# EAGLE design oscilateur (EAGLE 6.3)
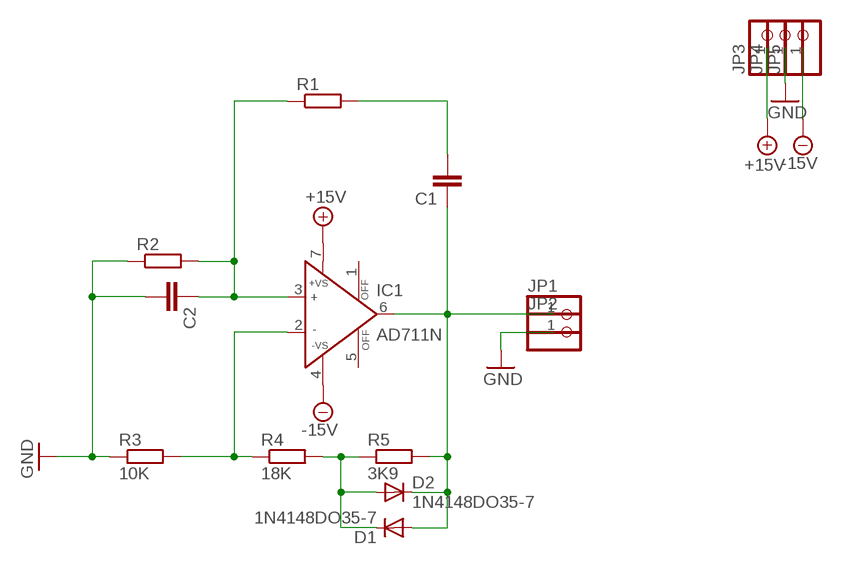
[diagram p0: schematic, sheet 1]

## Parts
C1  C-EU075-032X103  [C075-032X103]
C2  C-EU075-032X103  [C075-032X103]
D1  1N4148DO35-7  [DO35-7]
D2  1N4148DO35-7  [DO35-7]
IC1  AD711N  [DIL08]
JP1  PINHD-1X1  [1X01]
JP2  PINHD-1X1  [1X01]
JP3  PINHD-1X1  [1X01]
JP4  PINHD-1X1  [1X01]
JP5  PINHD-1X1  [1X01]
R1  R-EU_0204/7  [0204/7]
R2  R-EU_0204/7  [0204/7]
R3  10K  R-EU_0204/7  [0204/7]
R4  18K  R-EU_0204/7  [0204/7]
R5  3K9  R-EU_0204/7  [0204/7]

## Nets
+15V: IC1.7(+VS) JP3.1
-15V: IC1.4(-VS) JP5.1
GND: C2.2 JP2.1 JP4.1 R2.1 R3.1
N$1: IC1.2(IN-) R3.2 R4.1
N$2: D1.C D2.A R4.2 R5.1
N$3: C1.1 D1.A D2.C IC1.6(OUT) JP1.1 R5.2
N$4: C1.2 R1.2
N$5: C2.1 IC1.3(IN+) R1.1 R2.2
Unconnected: IC1.1(OFF) IC1.5(OFF)

## Library data of the parts
C1 C2 = resistor:C-EU: CAPACITOR, European symbol
D1 D2 = diode:1N4148: DIODE high speed (Philips)
IC1 = analog-devices:AD711: Precision, Low Cost, High Speed, BiFET Op Amp Source: http://www.analog.com/static/imported-files/data_sheets/AD711.pdf; MPN: AD711BQ; OC_FARNELL: 9604839; OC_NEWARK: 66F5826
JP1-JP5 = pinhead:PINHD-1X1: PIN HEADER
R1-R5 = resistor:R-EU_: RESISTOR, European symbol

## Board
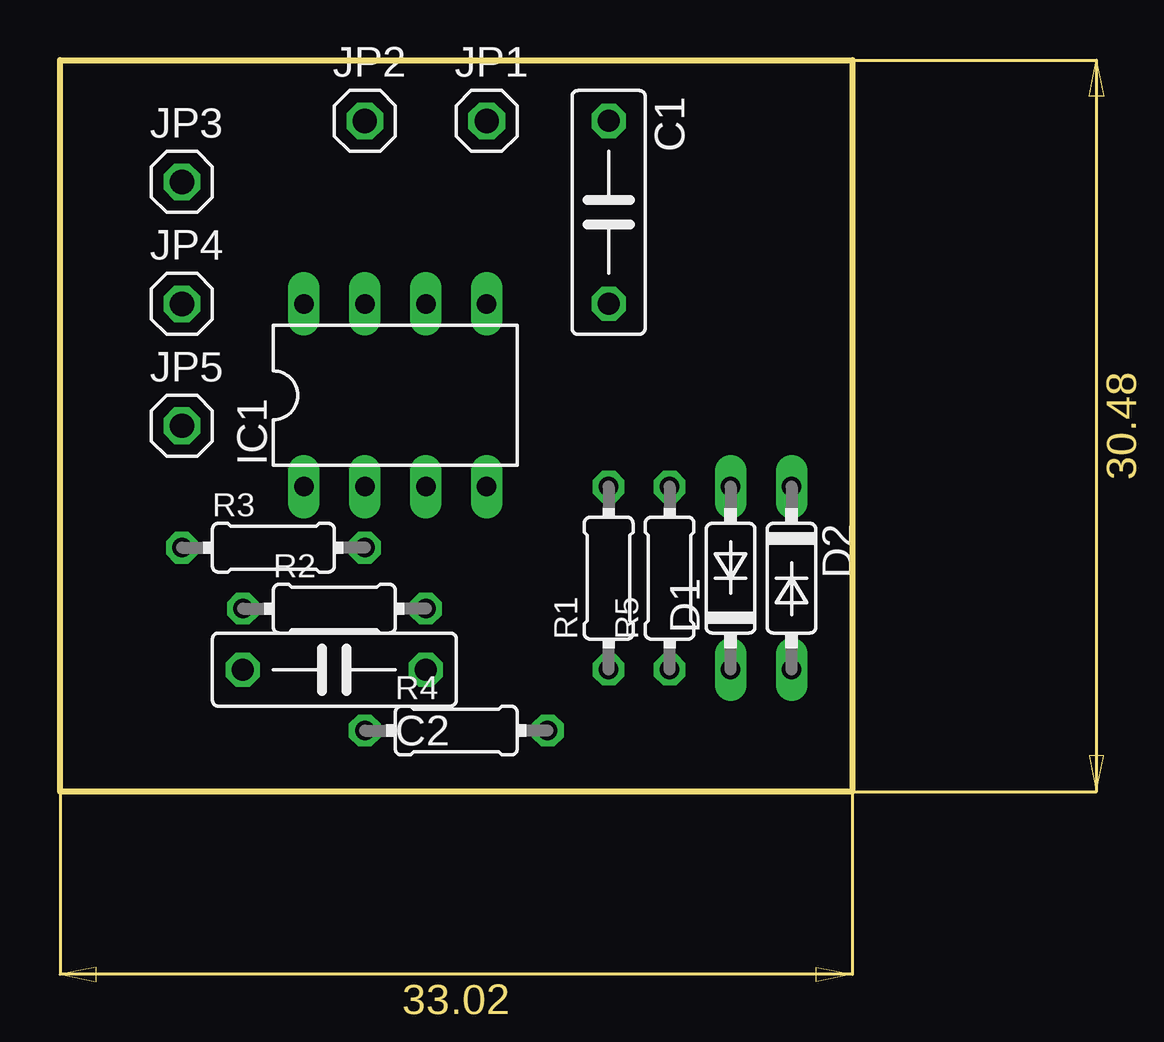
[diagram p1: board, top side]
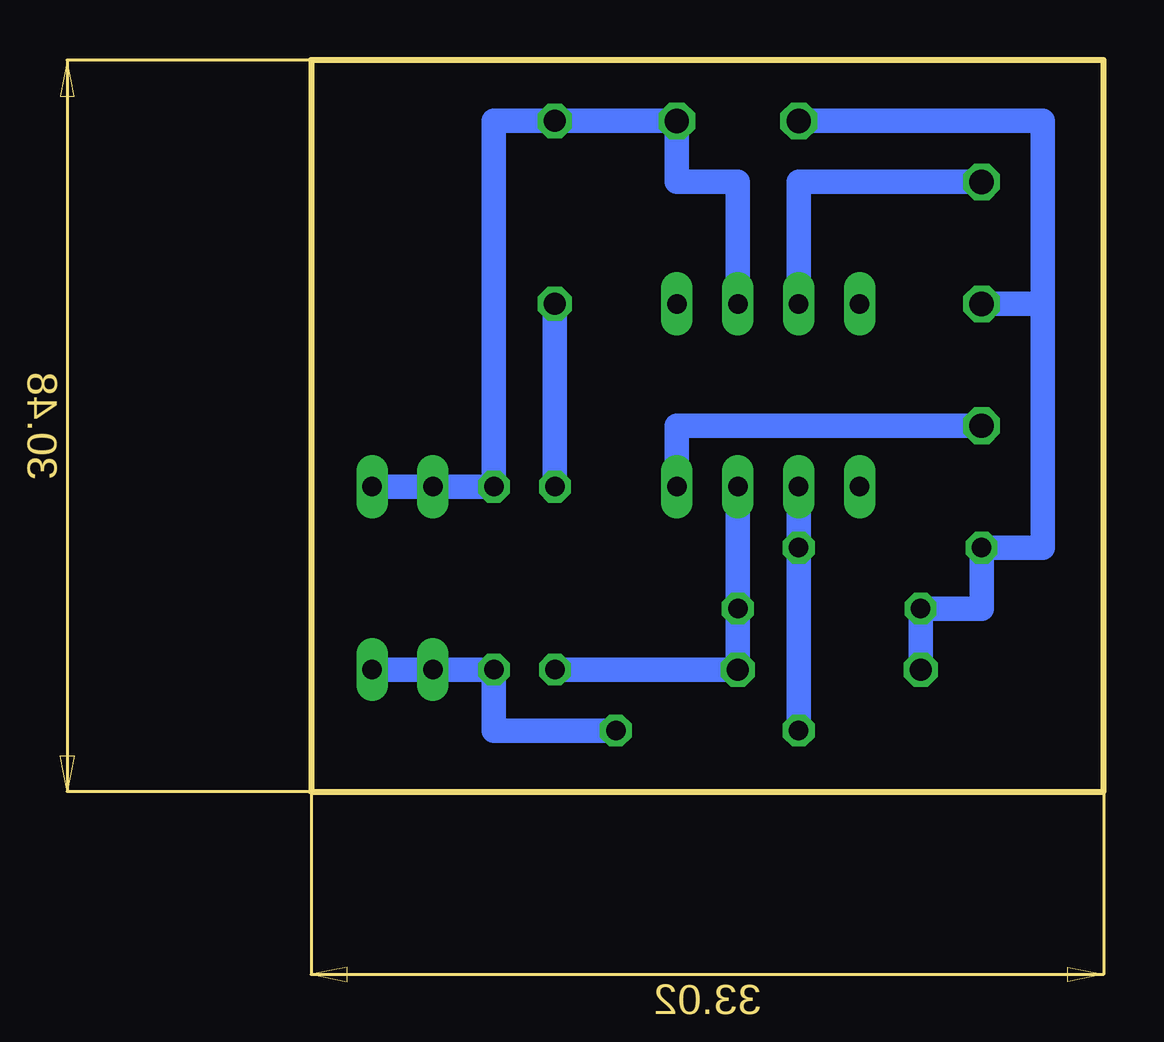
[diagram p2: board, bottom side, seen from below]

Size 33.02 x 30.48 mm. Coordinates in mm from the lower left corner, seen from the top.
Outline: 0,30.48 33.02,30.48 33.02,0 0,0 0,30.48
Copper layers (1*16): Top 0.035mm / dielectric 1.5mm / Bottom 0.035mm
Design rules "default": minimum track width 10mil, minimum drill 24mil, track to track 8mil, track to pad 8mil, pad to pad 8mil, via to via 8mil, smd to smd 8mil, copper to edge 40mil, drill to drill 8mil, minimum pad ring 10mil, minimum via ring 8mil, stop-mask expansion 4mil, vias tented up to drill 0mil, thermal gap 10mil

### Footprints (pad centres in the part's own frame; a part is rotated, then mirrored left to right if it is on the bottom)
C075-032X103 = drill 0.914 octagon: 1 -3.81,0; 2 3.81,0
DO35-7 = drill 0.813 long: A 3.81,0; C -3.81,0
DIL08 = drill 0.813 long: 1 -3.81,-3.81; 2 -1.27,-3.81; 3 1.27,-3.81; 4 3.81,-3.81; 5 3.81,3.81; 6 1.27,3.81; 7 -1.27,3.81; 8 -3.81,3.81
1X01 = drill 1.016 octagon: 1 0,0
0204/7 = drill 0.813 octagon: 1 -3.81,0; 2 3.81,0

### Placement (x,y rotation side)
C1  22.86,24.13 270 top
C2  11.43,5.08 180 top
D1  27.94,8.89 90 top
D2  30.48,8.89 270 top
IC1  13.97,16.51 0 top
JP1  17.78,27.94 0 top
JP2  12.7,27.94 0 top
JP3  5.08,25.4 0 top
JP4  5.08,20.32 0 top
JP5  5.08,15.24 0 top
R1  22.86,8.89 90 top
R2  11.43,7.62 0 top
R3  8.89,10.16 0 top
R4  16.51,2.54 0 top
R5  25.4,8.89 90 top

### Tracks (layer width: path | path; a pad name or v marks a point on that pad's centre or on a via)
+15V
  Bottom 1.016: JP3.1 12.7,25.4 IC1.7
-15V
  Bottom 1.016: JP5.1 17.78,15.24 IC1.4
GND
  Bottom 1.016: JP2.1 2.54,27.94 2.54,20.32 | 2.54,20.32 JP4.1 | 2.54,20.32 2.54,10.16 R3.1 5.08,7.62 R2.1 C2.2
N$1
  Bottom 1.016: IC1.2 R3.2 R4.1
N$2
  Bottom 1.016: R4.2 25.4,2.54 R5.1 D1.C D2.A
N$3
  Bottom 1.016: D2.C D1.A R5.2 25.4,27.94 C1.1 JP1.1 17.78,25.4 15.24,25.4 IC1.6
N$4
  Bottom 1.016: C1.2 R1.2
N$5
  Bottom 1.016: IC1.3 R2.2 C2.1 R1.1